# EAGLE design EADC (EAGLE 5.04)
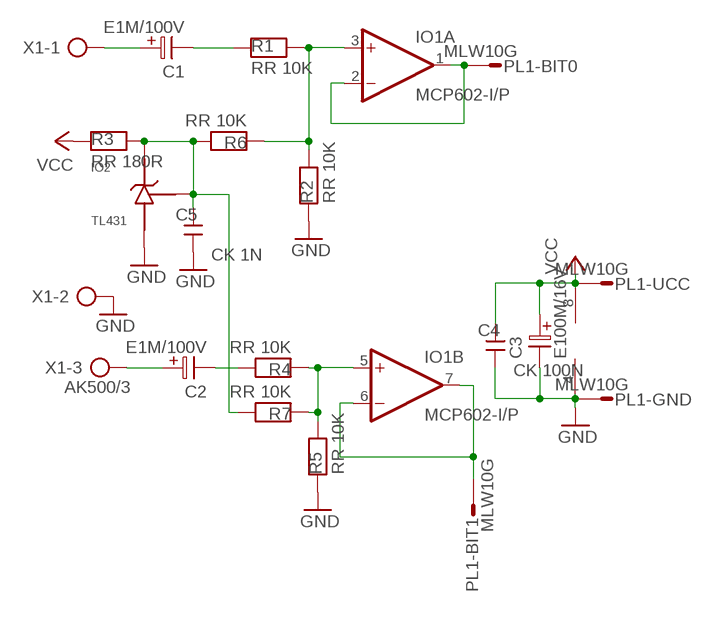
[diagram p0: schematic, sheet 1]

## Parts
C1  E1M/100V  CEL2,5  [ES-2,5L]
C2  E1M/100V  CEL2,5  [ES-2,5L]
C3  E100M/16V  CEL2,5  [ES-2,5L]
C4  CK 100N  C5  [C-5]
C5  CK 1N  C5  [C-5]
IO1  MCP602-I/P  MCP602P  [DIL08]
IO2  TL431  [SOT54A]
PL1  MLW10G  PSL10MLW10G  [MLW10G]
R1  RR 10K  R10  [R-10]
R2  RR 10K  R10  [R-10]
R3  RR 180R  R10  [R-10]
R4  RR 10K  R10  [R-10]
R5  RR 10K  R10  [R-10]
R6  RR 10K  R10  [R-10]
R7  RR 10K  R10  [R-10]
X1  AK500/3  [AK500/3]

## Nets
GND: C3.2 C4.2 C5.2 IO1.4(P:V-) IO2.B PL1.10 R2.1 R5.1 X1.2
N$1: C1.1 X1.1
N$2: C2.1 X1.3
N$3: C2.2 R4.2
N$4: C5.1 IO2.C IO2.E R3.2 R6.2 R7.2
N$5: C1.2 R1.1
N$6: IO1.5(B:+IN) R4.1 R5.2 R7.1
N$7: IO1.6(B:-IN) IO1.7(B:OUT) PL1.8
N$8: IO1.3(A:+IN) R1.2 R2.2 R6.1
N$9: IO1.1(A:OUT) IO1.2(A:-IN) PL1.9
VCC: C3.1 C4.1 IO1.8(P:V+) PL1.1 R3.1
Unconnected: PL1.2 PL1.3 PL1.4 PL1.5 PL1.6 PL1.7

## Library data of the parts
C1-C3 = !MOJE:CEL2,5
C4 C5 = !MOJE:C5
IO1 = linear:MCP602: Single Op Amp 2.7V to 6.0V Single Supply CMOS Source: http://ww1.microchip.com/downloads/en/DeviceDoc/21314g.pdf
IO2 = !MOJE:TL431
PL1 = !MOJE:PSL10: CONNECTOR
R1-R7 = !MOJE:R10
X1 = con-ptr500:AK500/3: CONNECTOR

## Board
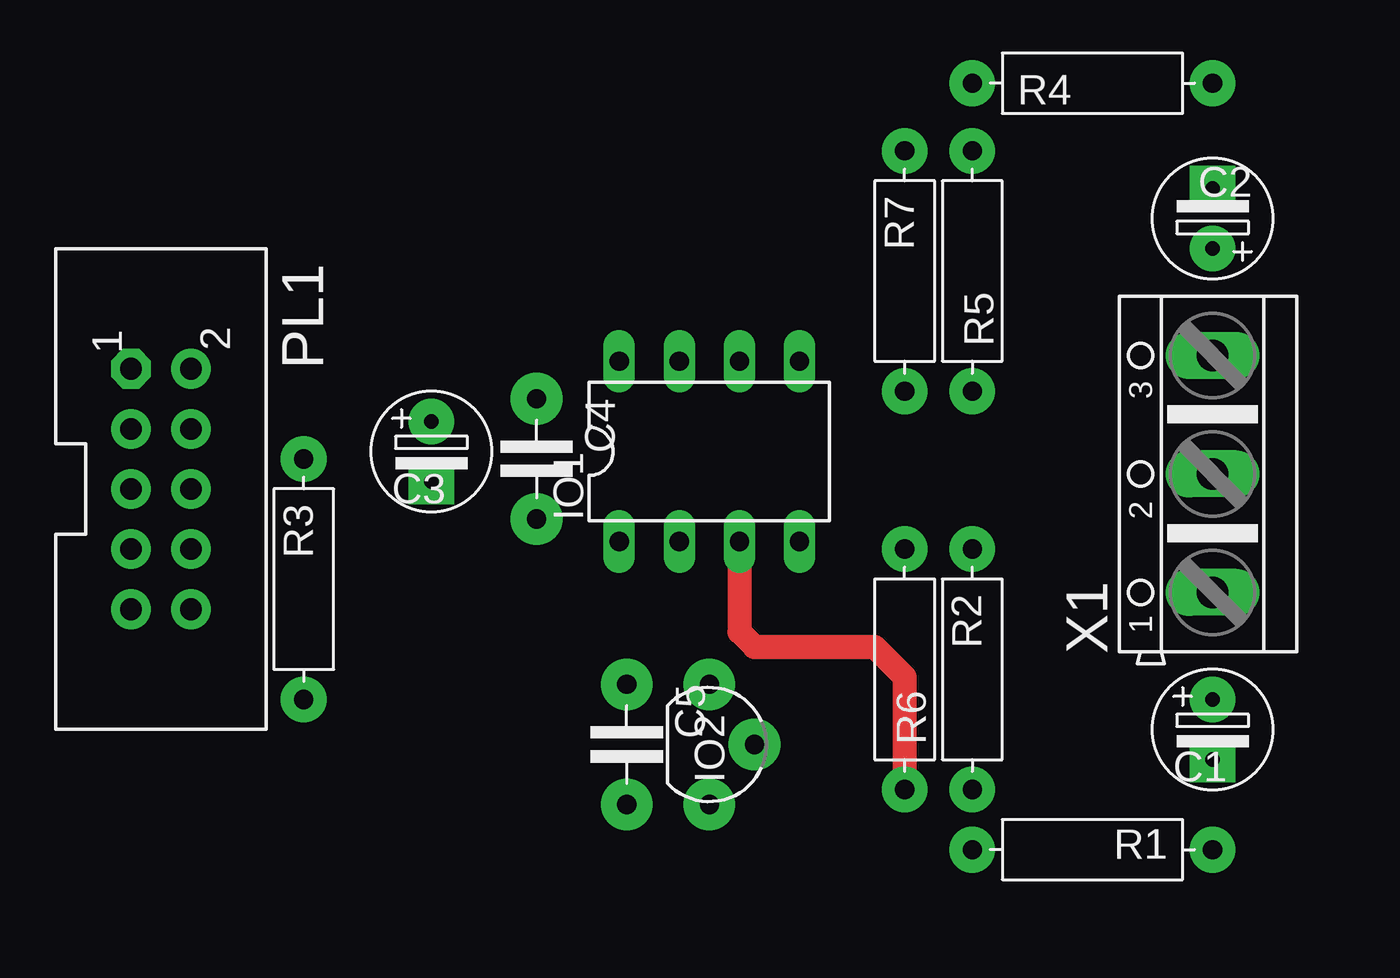
[diagram p1: board, top side]
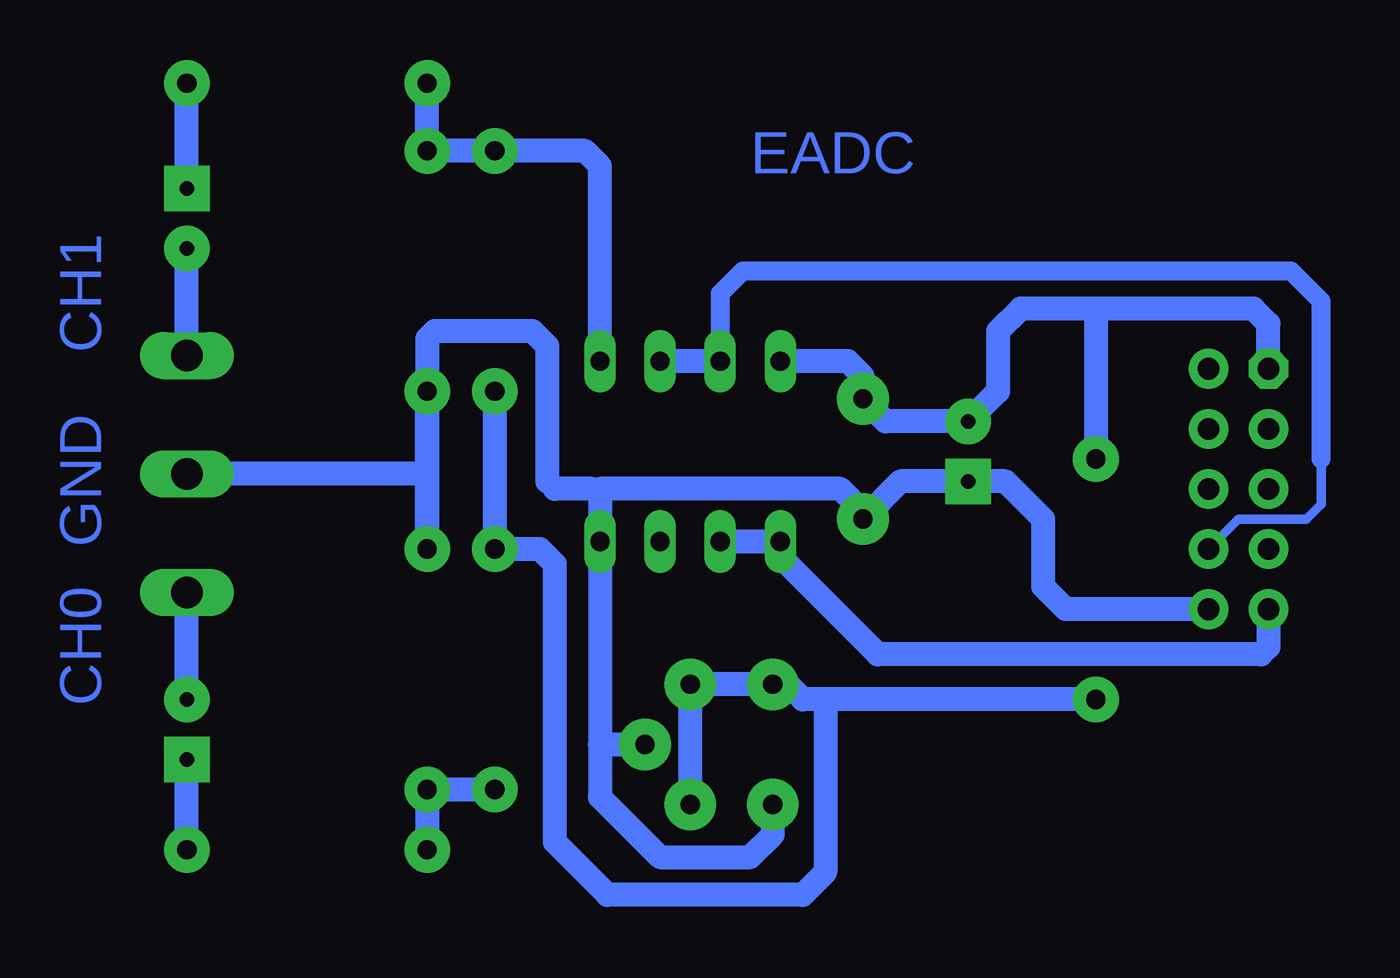
[diagram p2: board, bottom side, seen from below]

No outline drawn. Coordinates in mm, seen from the top.
Copper layers (1*16): Top 0.035mm / dielectric 1.5mm / Bottom 0.035mm
Design rules "default": minimum track width 10mil, minimum drill 24mil, track to track 8mil, track to pad 8mil, pad to pad 8mil, via to via 8mil, smd to smd 8mil, copper to edge 40mil, drill to drill 8mil, minimum pad ring 10mil, minimum via ring 8mil, stop-mask expansion 4mil, vias tented up to drill 0mil, thermal gap 10mil

### Footprints (pad centres in the part's own frame; a part is rotated, then mirrored left to right if it is on the bottom)
ES-2,5L = drill 0.61 pad 1.93 round: 1 0,0 | drill 0.61 pad 1.93 square: 2 2.54,0
C-5 = drill 0.813 pad 2.184 round: 1 -2.54,0; 2 2.54,0
DIL08 = drill 0.813 long: 1 -3.81,-3.81; 2 -1.27,-3.81; 3 1.27,-3.81; 4 3.81,-3.81; 5 3.81,3.81; 6 1.27,3.81; 7 -1.27,3.81; 8 -3.81,3.81
SOT54A = drill 0.813 pad 2.184 round: B 0,1.905; C -2.54,0; E 2.54,0
MLW10G = drill 0.914 pad 1.676 octagon: 1 -5.08,-1.27 | drill 0.914 pad 1.676 round: 2 -5.08,1.27; 3 -2.54,-1.27; 4 -2.54,1.27; 5 0,-1.27; 6 0,1.27; 7 2.54,-1.27; 8 2.54,1.27; 9 5.08,-1.27; 10 5.08,1.27
R-10 = drill 0.813 pad 1.93 round: 1 -5.08,0; 2 5.08,0
AK500/3 = drill 1.321 long: 1 -5.004,0; 2 0,0; 3 5.004,0

### Placement (x,y rotation side)
C1  51.44,9.53 270 top
C2  51.44,28.57 90 top
C3  18.41,21.27 270 top
C4  22.86,19.68 270 top
C5  26.67,7.62 270 top
IO1  30.16,20 0 top
IO2  30.16,7.62 270 top
PL1  6.99,18.41 270 top
R1  46.35,3.17 180 top
R2  41.27,10.79 270 top
R3  13.02,14.61 270 top
R4  46.35,35.56 0 top
R5  41.27,27.62 90 top
R6  38.42,10.79 90 top
R7  38.42,27.62 270 top
X1  51.44,19.05 90 top

### Tracks (layer width: path | path; a pad name or v marks a point on that pad's centre or on a via)
GND
  Bottom 0.813: 35.88,18.41 36.2,18.73 | 33.97,18.1 34.29,18.41
  Bottom 1.016: 41.27,19.37 R2.1 41.27,24.77 40.96,25.08 36.83,25.08 36.2,24.45 36.2,18.73 | 41.27,19.37 R5.1 | X1.2 41.27,19.05 41.27,19.37 | C5.2 26.67,3.81 27.62,2.86 31.43,2.86 33.97,5.4 33.97,7.62 | 33.97,7.62 IO1.4 33.97,18.1 33.97,18.41 23.81,18.41 22.86,17.46 C4.2 21.27,18.73 C3.2 16.83,18.73 15.24,17.14 15.24,14.29 14.29,13.34 PL1.10 | 33.97,7.62 IO2.B | 34.29,18.41 35.88,18.41
N$1
  Bottom 1.016: C1.1 X1.1
N$2
  Bottom 1.016: X1.3 C2.1
N$3
  Bottom 1.016: C2.2 R4.2
N$4
  Bottom 1.016: R7.2 R6.2 36.51,15.88 35.88,15.24 35.88,3.49 33.66,1.27 25.4,1.27 24.45,2.22 24.45,9.53 | R3.2 24.45,9.53 | 24.45,9.53 25.4,9.53 26.04,10.16 C5.1 IO2.C IO2.E
N$5
  Bottom 1.016: R1.1 C1.2
N$6
  Bottom 1.016: R4.1 R5.2 R7.1 34.61,32.7 33.97,32.07 IO1.5
N$7
  Bottom 0.406: PL1.8 6.99,17.14 4.13,17.14 3.49,17.78 3.49,19.68
  Bottom 0.813: 3.49,19.68 3.49,26.35 4.76,27.62 27.94,27.62 28.89,26.67 IO1.7
  Bottom 1.016: IO1.7 IO1.6
N$8
  Top 1.016: IO1.3 31.43,12.38 32.07,11.75 37.15,11.75 38.42,10.48 R6.1
  Bottom 1.016: R1.2 R2.2 R6.1
N$9
  Bottom 1.016: IO1.2 IO1.1 26.35,15.56 22.23,11.43 6.03,11.43 5.71,11.75 PL1.9
VCC
  Bottom 1.016: PL1.1 5.71,25.4 6.35,26.04 13.02,26.04 | 13.02,26.04 16.19,26.04 17.14,25.08 17.14,22.54 C3.1 21.91,21.27 C4.1 22.86,23.18 23.5,23.81 IO1.8 | 13.02,26.04 R3.1

### Text on the board
Bottom: EADC | CH1 | GND | CH0